# Altium schematic sheet 03-Gate_Driver.SchDoc
size B
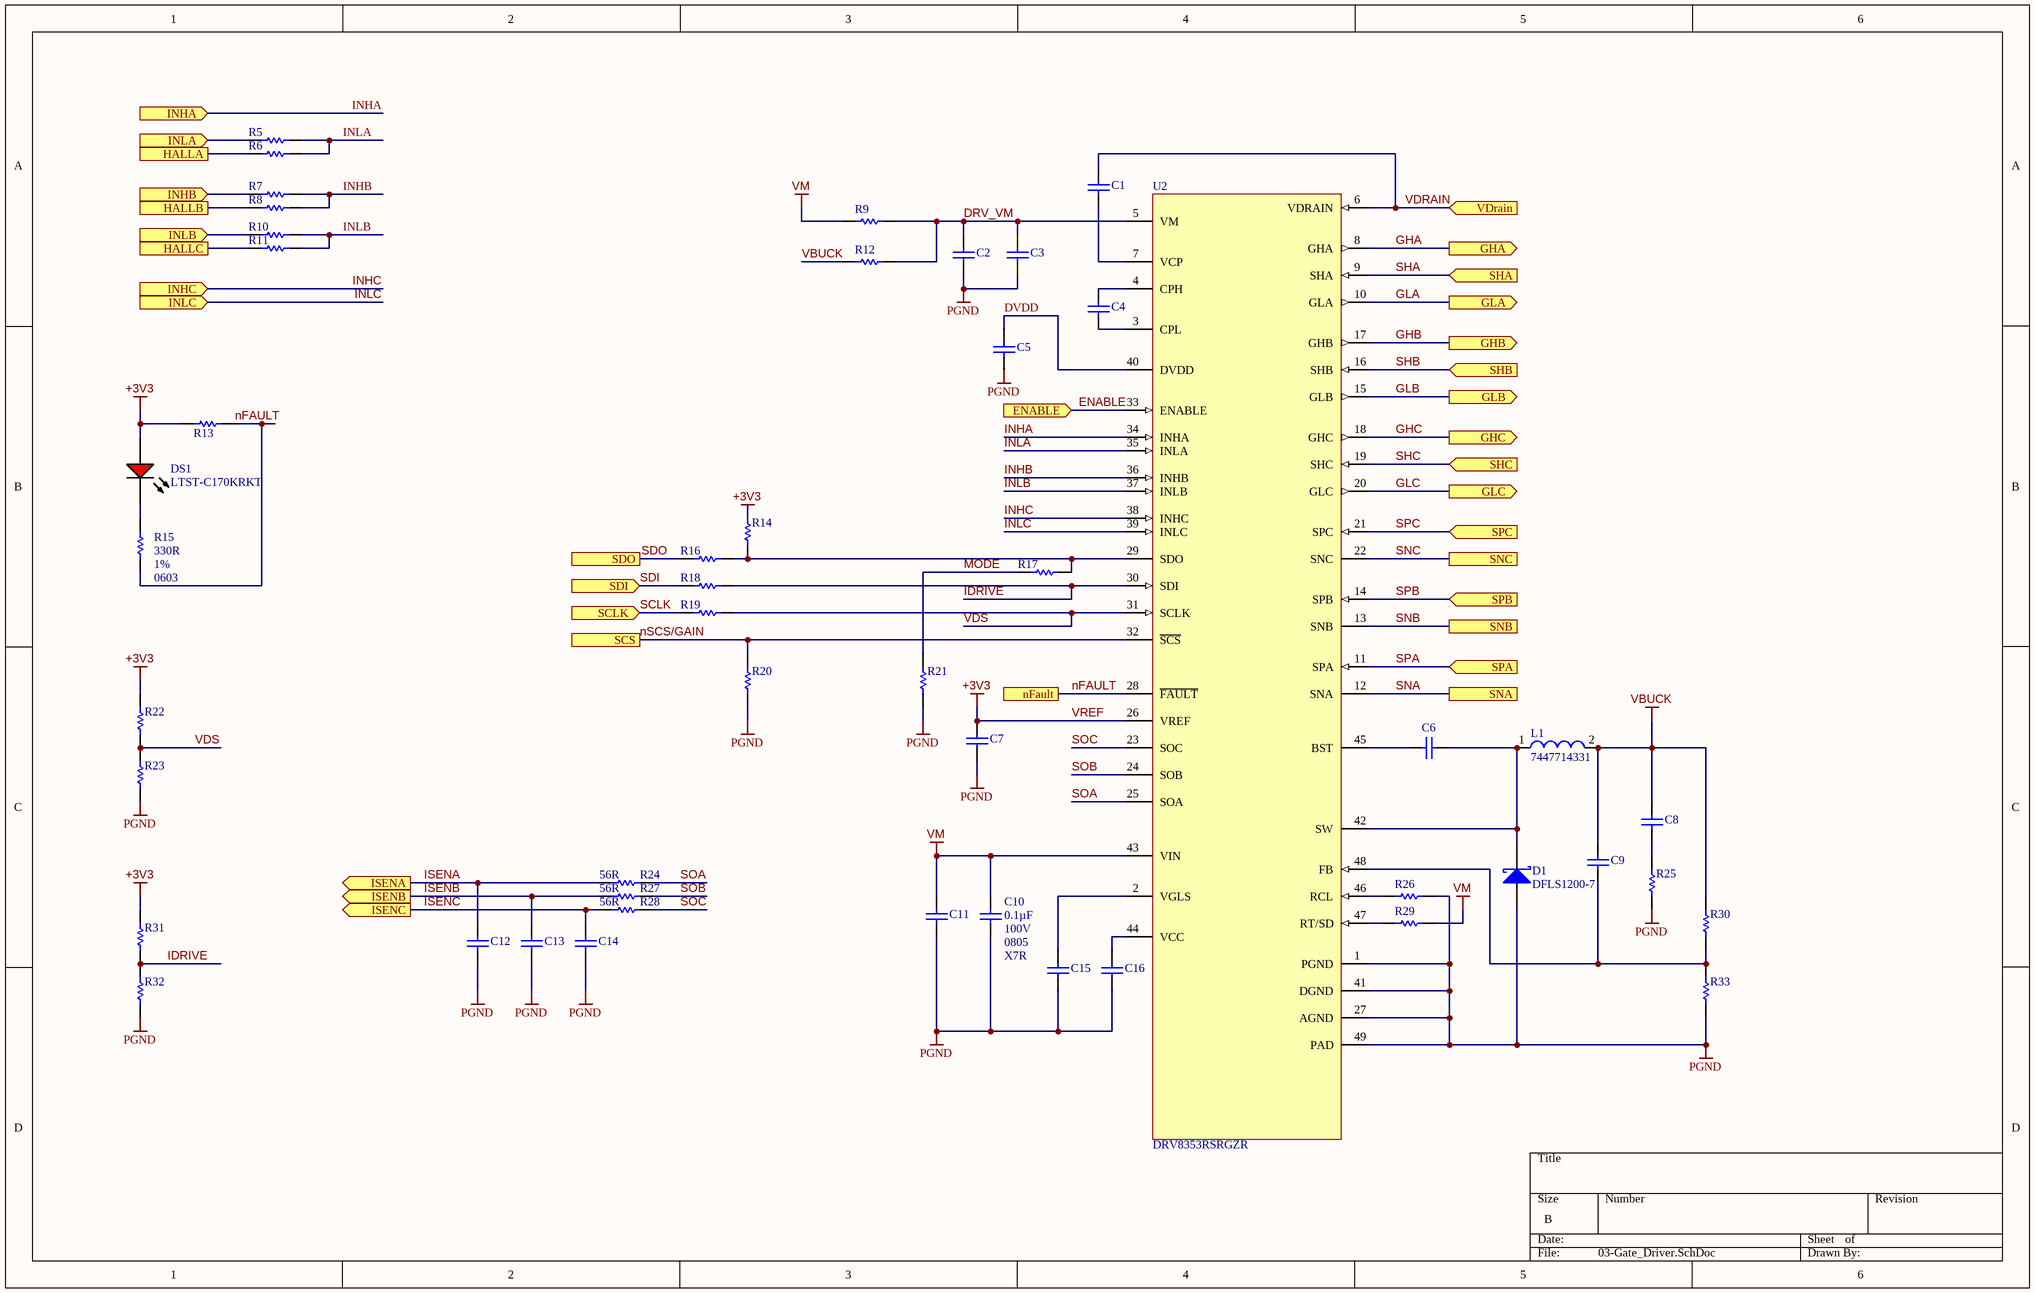
[diagram p0: 03-Gate_Driver.SchDoc]

## Parts
C1  GRM31CR72A105KA01L  [CAPC3216X180X55ML20T25]  (value not drawn)
C2  C5750X7S2A106M230KB  [TDK-C5750-2_L]  (value not drawn)
C3  C2012X7R2A104K125AA  [CAPC2013X145X20ML20]  (value not drawn)
C4  C0805C473K1RACTU  [CAPC2013X110X50LL20T25]  (value not drawn)
C5  C0603C105K4RACTU  [CAPC1608X90X35LL15T15]  (value not drawn)
C6  C0603C103K4RACTU  [CAPC1608X87X35ML15T15]  (value not drawn)
C7  C0603C104J4RACTU  [CAPC1608X87X35NL15T15]  (value not drawn)
C8  C2012X7R1H225K125AC  [CAPC2013X145X20LL20]  (value not drawn)
C9  GRM1885C1H362JA01D  [CAPC1608X90X35ML10T15]  (value not drawn)
C10  Temperature Coefficient: X7R  Voltage - Rated: 100V  Package Reference: 0805  Capacitance: 0.1µF  [CAPC2013X145X20ML20]  (hidden comment: C2012X7R2A104K125AA)
C11  C3216X7R2A105K160AA  [CAPC3216X180X20LL20]  (value not drawn)
C12  GRM188R71C222KA01D  [CAPC1608X90X35NL10T15]  (value not drawn)
C13  GRM188R71C222KA01D  [CAPC1608X90X35NL10T15]  (value not drawn)
C14  GRM188R71C222KA01D  [CAPC1608X90X35NL10T15]  (value not drawn)
C15  C0805C105K3RACTU  [CAPC2013X140X50LL20T25]  (value not drawn)
C16  C0603C105K4RACTU  [CAPC1608X90X35LL15T15]  (value not drawn)
D1  DFLS1200-7  [DIOD-POWERDI123-2_A_V]
DS1  LTST-C170KRKT  [LTST-C170KRKT_V]
L1  7447714331  [WE-PD 1050]
R5  ERJ-3GEY0R00V  [RESC1608X55X30NL15T15]  (value not drawn)
R6  ERJ-3GEY0R00V  [RESC1608X55X30NL15T15]  (value not drawn)
R7  ERJ-3GEY0R00V  [RESC1608X55X30NL15T15]  (value not drawn)
R8  ERJ-3GEY0R00V  [RESC1608X55X30NL15T15]  (value not drawn)
R9  ERJ-3GEY0R00V  [RESC1608X55X30NL15T15]  (value not drawn)
R10  ERJ-3GEY0R00V  [RESC1608X55X30NL15T15]  (value not drawn)
R11  ERJ-3GEY0R00V  [RESC1608X55X30NL15T15]  (value not drawn)
R12  ERJ-3GEY0R00V  [RESC1608X55X30NL15T15]  (value not drawn)
R13  RG1608P-103-B-T5  [RESC1608X50X30NL20T20]  (value not drawn)
R14  ERJ-3GEYJ102V  [RESC1608X55X30ML15T15]  (value not drawn)
R15  Case Code (Imperial): 0603  Tolerance: 1%  Resistance: 330R  [RESC1608X55X30NL15T15]  (hidden comment: ERJ3EKF3300V)
R16  ERJ-3GEY0R00V  [RESC1608X55X30NL15T15]  (value not drawn)
R17  ERJ-3GEY0R00V  [RESC1608X55X30NL15T15]  (value not drawn)
R18  ERJ-3GEY0R00V  [RESC1608X55X30NL15T15]  (value not drawn)
R19  ERJ-3GEY0R00V  [RESC1608X55X30NL15T15]  (value not drawn)
R20  CRCW060347K0JNEA  [RESC1609X50X30ML10T20]  (value not drawn)
R21  CRCW060347K0JNEA  [RESC1609X50X30ML10T20]  (value not drawn)
R22  CRCW060375K0JNEA  [RESC1609X50X30ML10T20]  (value not drawn)
R23  CRCW060375K0JNEA  [RESC1609X50X30ML10T20]  (value not drawn)
R24  Resistance: 56R  [RESC1609X50X30ML10T20]  (hidden comment: CRCW060356R0FKEA)
R25  2R61 1% 0603(1608)  [RESC0603(1608)_N]  (value not drawn)
R26  CRCW0603107KFKEA  [RESC1609X50X30LL10T20]  (value not drawn)
R27  Resistance: 56R  [RESC1609X50X30ML10T20]  (hidden comment: CRCW060356R0FKEA)
R28  Resistance: 56R  [RESC1609X50X30ML10T20]  (hidden comment: CRCW060356R0FKEA)
R29  ERJ-3EKF2743V  [RESC1608X55X30NL15T15]  (value not drawn)
R30  RG1608P-103-B-T5  [RESC1608X50X30NL20T20]  (value not drawn)
R31  CRCW060375K0JNEA  [RESC1609X50X30ML10T20]  (value not drawn)
R32  CRCW060375K0JNEA  [RESC1609X50X30ML10T20]  (value not drawn)
R33  RG1608P-2611-B-T5  [RESC1608X50X30NL20T20]  (value not drawn)
U2  DRV8353RSRGZR  [DRV8353RS]

## Ports
ENABLE (in), GHA (out), GHB (out), GHC (out), GLA (out), GLB (out), GLC (out), HALLA, HALLB, HALLC, INHA (in), INHB (in), INHC (in), INLA (in), INLB (in), INLC (in), ISENA (out), ISENB (out), ISENC (out), nFault, SCLK (in), SCS, SDI (in), SDO, SHA (in), SHB (in), SHC (in), SNA, SNB, SNC, SPA (in), SPB (in), SPC (in), VDrain (in)

## Nets
PGND: C2.1 C3.1 C5.1 C7.1 C10.1 C11.1 C12.1 C13.1 C14.1 C15.1 C16.1 D1.1(A) R20.1 R21.1 R23.2 R25.1 R26.2 R32.2 R33.1 U2.1(PGND) U2.27(AGND) U2.41(DGND) U2.49(PAD)
VBUCK: C8.2 C9.2 L1.2 R12.1 R30.2
VM: C10.2 C11.2 R9.1 R29.2 U2.43(VIN)
VREF: C7.2 DS1.1(A) R13.2 R14.2 R22.1 R31.1 U2.26(VREF)  [also labelled +3V3]
DRV_VM: C2.2 C3.2 R9.2 R12.2 U2.5(VM)
DVDD: C5.2 U2.40(DVDD)
ENABLE: U2.33(ENABLE) ; port ENABLE
GHA: U2.8(GHA) ; port GHA
GHB: U2.17(GHB) ; port GHB
GHC: U2.18(GHC) ; port GHC
GLA: U2.10(GLA) ; port GLA
GLB: U2.15(GLB) ; port GLB
GLC: U2.20(GLC) ; port GLC
HALLA: R6.1 ; port HALLA
HALLB: R8.1 ; port HALLB
HALLC: R11.1 ; port HALLC
IDRIVE: R18.2 R31.2 R32.1 U2.30(SDI)
INHA: U2.34(INHA) ; port INHA
INHB: R7.2 R8.2 U2.36(INHB)
INHB: R7.1 ; port INHB  [a separate net that carries the same name]
INHC: U2.38(INHC) ; port INHC
INLA: R5.2 R6.2 U2.35(INLA)
INLA: R5.1 ; port INLA  [a separate net that carries the same name]
INLB: R10.2 R11.2 U2.37(INLB)
INLB: R10.1 ; port INLB  [a separate net that carries the same name]
INLC: U2.39(INLC) ; port INLC
ISENA: C12.2 R24.1 ; port ISENA
ISENB: C13.2 R27.1 ; port ISENB
ISENC: C14.2 R28.1 ; port ISENC
MODE: R17.1 R21.2
nFAULT: R13.1 R15.1 U2.28(~{FAULT}) ; port nFault
nSCS/GAIN: R20.2 U2.32(~{SCS}) ; port SCS
SCLK: R19.1 ; port SCLK
SDI: R18.1 ; port SDI
SDO: R16.1 ; port SDO
SHA: U2.9(SHA) ; port SHA
SHB: U2.16(SHB) ; port SHB
SHC: U2.19(SHC) ; port SHC
SNA: U2.12(SNA) ; port SNA
SNB: U2.13(SNB) ; port SNB
SNC: U2.22(SNC) ; port SNC
SOA: R24.2 U2.25(SOA)
SOB: R27.2 U2.24(SOB)
SOC: R28.2 U2.23(SOC)
SPA: U2.11(SPA) ; port SPA
SPB: U2.14(SPB) ; port SPB
SPC: U2.21(SPC) ; port SPC
VDRAIN: C1.2 U2.6(VDRAIN) ; port VDrain
VDS: R19.2 R22.2 R23.1 U2.31(SCLK)
NetC1_1: C1.1 U2.7(VCP)
NetC4_1: C4.1 U2.3(CPL)
NetC4_2: C4.2 U2.4(CPH)
NetC6_1: C6.1 U2.45(BST)
NetC6_2: C6.2 D1.2(K) L1.1 U2.42(SW)
NetC8_1: C8.1 R25.2
NetC9_1: C9.1 R30.1 R33.2 U2.48(FB)
NetC15_2: C15.2 U2.2(VGLS)
NetC16_2: C16.2 U2.44(VCC)
NetDS1_2: DS1.2(K) R15.2
NetR14_1: R14.1 R16.2 R17.2 U2.29(SDO)
NetR26_1: R26.1 U2.46(RCL)
NetR29_1: R29.1 U2.47(RT/SD)

## Library data of the parts
C1 = CMP-2000-04948-1: Chip Capacitor, 1 uF, +/- 10%, 100 V, -55 to 125 degC, 1206 (3216 Metric), RoHS, Tape and Reel; Manufacturer: Murata; Catalog Drawings: GRMSeries_1206_1.6; Featured Product: GA3SafetyRecognizedCapsandHi-CapMLCC; Online Catalog: GRMSeries; Temperature Coefficient: X7R; Product Training Modules: High-CapMultilayerCeramicCapacitors; Other Names: 490-3909-6; Voltage - Rated: 100V; Capacitance: 1µF; Thickness (Max): 0.071"(1.80mm); Height - Seated (Max): -; Features: -; Applications: GeneralPurpose; Manufacturer URL: http://www.murata.com/; Standard Package: 1; Size / Dimension: 0.126"Lx0.063"W(3.20mmx1.60mm); Package Reference: 1206; Series: GRM; Package / Case: 1206(3216Metric); Datasheet Version: Sep-11; Ratings: -; Category: Capacitors; Datasheet URL: https://datasheet.ciiva.com/29199/454987-da-01-en-vs-kondensator-1206-29199435.pdf; Operating Temperature: -55degC~125degC; Lead Spacing: -; Family: CeramicCapacitors; Tolerance: ±10%; Packaging: Digi-Reel; Mounting Type: SurfaceMount,MLCC; Package Description: 2-Pin Surface Mount Device, Body 3.2 x 1.6 mm; Lead Style: -
C2 = CMP-2000-06059-1: Chip Capacitor, 10 uF, +/- 20%, 100 V, -55 to 125 degC, 2220 (5750 Metric), RoHS, Tape and Reel; PCN Part Number: MLCCPartNumberChange30/Nov/2012; Manufacturer: TDK; Other Names: 445-5212-1; Featured Product: Compact,High-CapacitanceMultilayerCeramicChipCapacitorsMidVoltageX7S-100VMLCCsC-SeriesMidVoltageMLCCs; Product Training Modules: SEAT,CCV,andTVCLDesignToolsCSeriesMidVoltageCapacitorsFamilyGuidetoReplacinganElectrolyticCapacitorwithanMLCC; Kits: 445-9009-KIT-ND-KITCAPCERHICAP100V-630VSMDSAMPLEKIT1008-ND-KITCAPCERMLCC100V-630V; Catalog Drawings: CSERIES_2220_2.5; Online Catalog: CSeries,MidVoltage; Temperature Coefficient: X7S; Voltage - Rated: 100V; Capacitance: 10µF; Package Description: SMD, 2-Leads, Body 6.1 x 5.4 mm; Manufacturer URL: http://www.tdk.com/; Size / Dimension: 0.224"Lx0.197"W(5.70mmx5.00mm); RoHS Information: RoHSCertificate-MLCC; Package Reference: C5750-2; Applications: GeneralPurpose; Datasheet Version: 09/2013; Features: -; Datasheet URL: https://datasheet.ciiva.com/24216/c5750x7s2a106m230kb-265716-24216594.pdf; Standard Package: 1; Lead Spacing: -; Family: CeramicCapacitors; Thickness (Max): 0.098"(2.50mm); Packaging: CutTape(CT); Mounting Technology: SurfaceMount; Lead Style: -; Height - Seated (Max): -; Package / Case: 2220(5750Metric); Series: C; Category: Capacitors; Ratings: -; Operating Temperature: -55°C~125°C; Mounting Type: SurfaceMount,MLCC; Tolerance: ±20%
C3 = CMP-2000-05453-1: Chip Capacitor, 100 nF, +/- 10%, 100 V, -55 to 1255 degC, 0805 (2012 Metric), RoHS, Tape and Reel; Manufacturer: TDK; PCN Part Number: MLCCPartNumberChange30/Nov/2012; Temperature Coefficient: X7R; Voltage - Rated: 100V; Kits: SAMPLEKIT1008-ND-KITCAPCERMLCC100V-630V; Other Names: 445-1418-1; Online Catalog: CSeries,MidVoltage; Featured Product: C-SeriesMidVoltageMLCCs; Catalog Drawings: CSERIES_2012-0805_1.45; Product Training Modules: HighCapacitanceReplacementSEAT,CCV,andTVCLDesignToolsGuidetoReplacinganElectrolyticCapacitorwithanMLCC; Capacitance: 0.1µF; Applications: GeneralPurpose; Datasheet Version: Jul-13; Mounting Type: SurfaceMount,MLCC; Height - Seated (Max): -; Packaging: CutTape(CT); Datasheet URL: https://datasheet.ciiva.com/11788/0900766b80fc5cba-11788142.pdf; Tolerance: ±10%; Package Reference: 805; Manufacturer URL: http://www.tdk.com/; Thickness (Max): 0.057"(1.45mm); Series: C; Lead Style: -; Operating Temperature: -55degC~125degC; Category: Capacitors; Package Description: 2-Pin Surface Mount Device, Body 2 x 1.25 mm; Standard Package: 1; Package / Case: 0805(2012Metric); Family: CeramicCapacitors; RoHS Information: RoHSCertificate-MLCC; Size / Dimension: 0.079"Lx0.049"W(2.00mmx1.25mm); Lead Spacing: -; Ratings: -; Features: -
C4 = CMP-2007-03657-1: Manufacturer: Kemet; Part Number: C0805C473K1RACTU
C5 C16 = CMP-2006-02240-1: Manufacturer: Kemet; Part Number: C0603C105K4RACTU
C6 = CMP-2006-03042-1: Manufacturer: Kemet; Part Number: C0603C103K4RACTU
C7 = CMP-2006-03054-1: Manufacturer: Kemet; Part Number: C0603C104J4RACTU
C8 = CMP-2000-06040-1: Chip Capacitor, 2.2 uF, +/- 10%, 50 V, -55 to 125 degC, 0805 (2012 Metric), RoHS, Tape and Reel; Manufacturer: TDK; PCN Part Number: MLCCPartNumberChange30/Nov/2012; Other Names: 445-5968-1; Temperature Coefficient: X7R; Catalog Drawings: CSERIES_2012-0805_1.45; Kits: 445-9015-KIT-ND-KITMLCC1000PF-47UF080510-50V445-9003-KIT-ND-KITCAPCERHICAPMLCCSMD445-173086-KIT-ND-C0402-2220X7R6.3-50V1,000PF-; Online Catalog: CSeries,GeneralPurpose; Voltage - Rated: 50V; Capacitance: 2.2µF; Product Training Modules: CSeriesGeneralApplicationsSEAT,CCV,andTVCLDesignToolsGuidetoReplacinganElectrolyticCapacitorwithanMLCC; Operating Temperature: -55°C~125°C; Features: -; Tolerance: ±10%; Datasheet URL: https://datasheet.ciiva.com/24216/c2012x7r1h225k125ac-265016-24216364.pdf; Lead Style: -; Size / Dimension: 0.079"Lx0.049"W(2.00mmx1.25mm); Mounting Technology: SurfaceMount; Package Reference: 0805; Thickness (Max): 0.057"(1.45mm); RoHS Information: RoHSCertificate-MLCC; Height - Seated (Max): -; Manufacturer URL: http://www.tdk.com/; Standard Package: 1; Category: Capacitors; Package Description: 2-Pin Surface Mount Device, Body 2 x 1.25 mm; Packaging: CutTape(CT); Series: C; Applications: GeneralPurpose; Package / Case: 0805(2012Metric); Ratings: -; Datasheet Version: 09/2013; Family: CeramicCapacitors; Mounting Type: SurfaceMount,MLCC; Lead Spacing: -
C9 = CMP-2006-02551-1: Manufacturer: Murata; Part Number: GRM1885C1H362JA01D
C10 = CMP-2000-05453-1: Chip Capacitor, 100 nF, +/- 10%, 100 V, -55 to 1255 degC, 0805 (2012 Metric), RoHS, Tape and Reel; Manufacturer: TDK; PCN Part Number: MLCCPartNumberChange30/Nov/2012; Kits: SAMPLEKIT1008-ND-KITCAPCERMLCC100V-630V; Other Names: 445-1418-1; Online Catalog: CSeries,MidVoltage; Featured Product: C-SeriesMidVoltageMLCCs; Catalog Drawings: CSERIES_2012-0805_1.45; Product Training Modules: HighCapacitanceReplacementSEAT,CCV,andTVCLDesignToolsGuidetoReplacinganElectrolyticCapacitorwithanMLCC; Applications: GeneralPurpose; Datasheet Version: Jul-13; Mounting Type: SurfaceMount,MLCC; Height - Seated (Max): -; Packaging: CutTape(CT); Datasheet URL: https://datasheet.ciiva.com/11788/0900766b80fc5cba-11788142.pdf; Tolerance: ±10%; Manufacturer URL: http://www.tdk.com/; Thickness (Max): 0.057"(1.45mm); Series: C; Lead Style: -; Operating Temperature: -55degC~125degC; Category: Capacitors; Package Description: 2-Pin Surface Mount Device, Body 2 x 1.25 mm; Standard Package: 1; Package / Case: 0805(2012Metric); Family: CeramicCapacitors; RoHS Information: RoHSCertificate-MLCC; Size / Dimension: 0.079"Lx0.049"W(2.00mmx1.25mm); Lead Spacing: -; Ratings: -; Features: -
C11 = CMP-2000-06049-1: Chip Capacitor, 1 uF, +/- 10%, 100 V, -55 to 125 degC, 1206 (3216 Metric), RoHS, Tape and Reel; Manufacturer: TDK; PCN Part Number: MLCCPartNumberChange30/Nov/2012; Kits: SAMPLEKIT1008-ND-KITCAPCERMLCC100V-630V; Product Training Modules: SEAT,CCV,andTVCLDesignToolsGuidetoReplacinganElectrolyticCapacitorwithanMLCC; Capacitance: 1µF; Featured Product: C-SeriesMidVoltageMLCCs; Voltage - Rated: 100V; Other Names: 445-4467-1; Catalog Drawings: CSERIES_1206_1.8; Online Catalog: CSeries,MidVoltage; Temperature Coefficient: X7R; Features: -; Family: CeramicCapacitors; Datasheet URL: http://www.farnell.com/datasheets/1484596.pdf; Mounting Technology: SurfaceMount; Mounting Type: SurfaceMount,MLCC; Datasheet Version: 08/2011; Standard Package: 1; Package / Case: 1206(3216Metric); Thickness (Max): 0.051"(1.30mm); Size / Dimension: 0.126"Lx0.063"W(3.20mmx1.60mm); Applications: GeneralPurpose; Package Reference: 1206; Operating Temperature: -55°C~125°C; Packaging: CutTape(CT); Package Description: 2-Pin Surface Mount Device, Body 3.2 x 1.6 mm; Ratings: -; Series: C; Tolerance: ±10%; Manufacturer URL: http://www.tdk.com/; Lead Spacing: -; Height - Seated (Max): -; Package URL: https://product.tdk.com/info/en/documents/chara_sheet/C3216X7R1V106K160AC.pdf; Lead Style: -; Category: Capacitors; RoHS Information: RoHSCertificate-MLCC
C12-C14 = CMP-2006-02517-1: Manufacturer: Murata; Part Number: GRM188R71C222KA01D
C15 = CMP-2007-03234-1: Manufacturer: Kemet; Part Number: C0805C105K3RACTU
D1 = CMP-2000-07540-1: High Voltage Schottky Barrier Rectifier, 200 V, 1 A, -65 to 175 degC, 2-Pin SMD, RoHS, Tape and Reel; Manufacturer: Diodes Inc; Peak Non-Repetitive Surge Current: 40A; Max Repetitive Reverse Voltage (Vrrm): 200V; Peak Reverse Current: 2uA; Capacitance: 23pF; Forward Current: 1A; Forward Voltage: 850mV; Element Configuration: Single; Polarity: Standard; Number of Pins: 2; Package Description: 2-Pin Small Outline Diode, Body 2.8 x 1.78 mm; Mount: SurfaceMount; Max Operating Temperature: 150degC; Package Quantity: 3000; Lead Free: LeadFree; Max Forward Surge Current (Ifsm): 40A; Height: 0.98mm; Datasheet Version: Rev. 6-2, 10/2008; Package Reference: POWERDI123-2_A; Reverse Voltage (DC): 200V; REACH SVHC: NoSVHC; Min Operating Temperature: -65degC; RoHSCompliant: true; Width: 1.78mm; Contact Plating: Matte; Termination: SMD/SMT; Manufacturer URL: http://www.diodes.com/; Voltage Rating (DC): 200V; Length: 2.8mm; Output Current: 1A; Packaging: TapeandReel; Current Rating: 1A; Radiation Hardening: No; Mounting Technology: SurfaceMount; Average Rectified Current: 1A; Datasheet URL: https://www.diodes.com/assets/Datasheets/ds30628.pdf
DS1 = CMP-2000-07593-1: LED Red, 75 mW, 54 mcd, -55 to 85 degC, 2-Pin SMD, RoHS, Tape and Reel; Manufacturer: Lite-On; Lens Transparency: Clear; Number of Elements: 1; Power Rating: 75mW; Luminous Intensity: 54mcd; Viewing Angle: 130degrees; Forward Current: 30mA; Wavelength: 639nm; Lens Style: Rectangular; Case\/Package: 0805; Test Current: 20mA; Dominant Wavelength: 631nm; Forward Voltage: 2V; Lens Colour: Colorless; Min Operating Temperature: -55degC; RoHSCompliant: True; Length: 3.2mm; Width: 1.25mm; Mount: SurfaceMount; Packaging: TapeandReel; Number of LEDs: 1; Radiation Hardening: No; Datasheet URL: http://optoelectronics.liteon.com/upload/download/DS-22-99-0150/LTST-C170KRKT.pdf; Datasheet Version: Rev. D, 11/2014; Case Code (Metric): 2012; Height: 1.1mm; Number of Pins: 2; Package Description: 2-Pin Surface Mount Device, Body 2 x 1.25 mm; Manufacturer URL: http://www.us.liteon.com/; Lead Free: LeadFree; Illumination Colour: Red; Colour: Red; Case Code (Imperial): 0805; Max Operating Temperature: 85degC; Power Dissipation: 75mW; Mounting Technology: SurfaceMount; Package Reference: C170KRKT; Package Quantity: 1; Depth: 1.6mm
L1 = CMP-1396-00019-1: SMD-Shielded Power Inductor WE-PD, L=330 µH; Manufacturer: Wuerth Elektronik; Inductance: 330 ÂµH; PackageReference: WE-PD 1050; ComponentLink1URL: http://www.we-online.com; ComponentLink1Description: Manufacturer URL; ComponentLink2Description: Datasheet; PartNumber: 7447714331; ComponentLink2URL: http://www.we-online.de/katalog/media/pdf/7447714331.pdf
R5-R12 R16-R19 = CMP-2000-00700-1: Manufacturer: Panasonic; Part Number: ERJ-3GEY0R00V
R13 R30 = CMP-2000-01968-1: Manufacturer: Susumu; Part Number: RG1608P-103-B-T5
R14 = CMP-2000-00703-1: Manufacturer: Panasonic; Part Number: ERJ-3GEYJ102V
R15 = CMP-2000-00435-1: Manufacturer: Panasonic; Power Rating: 100mW; Voltage Rating: 75V; Temperature Coefficient: 100ppm/°C; Part Number: ERJ3EKF3300V; Supplier 1: Newark; Supplier Part Number 1: 85Y8676; Manufacturer Part Number: ERJ3EKF3300V; Stock 1: 0; RoHS: Yes; Mount: Surface Mount; Case/Package: 0603; Number of Pins: 2; Weight: 7.1E-05oz; Case Code (Metric): 1608; Contact Plating: Tin; Min Operating Temperature: -55°C; Max Operating Temperature: 155°C; Packaging: Tape and Reel; Composition: Thick Film; Package Quantity: 5000; Military Standard: Not; Termination: SMD/SMT; Number of Terminations: 2; Max Power Dissipation: 100mW; Voltage Rating (DC): 75V; Features: Automotive AEC-Q200; Length: 1.6mm; Height: 0.45mm; Width: 0.8mm; Depth: 0.8mm; Radiation Hardening: No; REACH SVHC: No SVHC; Lead Free: Lead Free; ComponentLink1URL: https://datasheet.ciiva.com/7886/aoa0000ce2-7886729.pdf?src-supplier=Element14; ComponentLink1Description: https://datasheet.ciiva.com/7886/aoa0000ce2-7886729.pdf?src-supplier=Element14; ComponentLink2URL: https://datasheet.ciiva.com/48531/aoa0000ce2-48531001.pdf?src-supplier=Avnet; ComponentLink2Description: https://datasheet.ciiva.com/48531/aoa0000ce2-48531001.pdf?src-supplier=Avnet; ComponentLink3URL: https://datasheet.ciiva.com/22721/426256-22721099.pdf?src-supplier=Element14; ComponentLink3Description: https://datasheet.ciiva.com/22721/426256-22721099.pdf?src-supplier=Element14; ComponentLink4URL: https://datasheet.ciiva.com/46373/1678782-46373899.pdf?src-supplier=Element14; ComponentLink4Description: https://datasheet.ciiva.com/46373/1678782-46373899.pdf?src-supplier=Element14; ComponentLink5URL: https://datasheet.ciiva.com/9117/aoa0000ce2-9117132.pdf?src-supplier=Avnet; ComponentLink5Description: https://datasheet.ciiva.com/9117/aoa0000ce2-9117132.pdf?src-supplier=Avnet; ComponentLink6URL: https://datasheet.ciiva.com/46373/1678782-46373900.pdf?src-supplier=Element14; ComponentLink6Description: https://datasheet.ciiva.com/46373/1678782-46373900.pdf?src-supplier=Element14
R20 R21 = CMP-2000-03381-1: Manufacturer: Vishay Dale; Part Number: CRCW060347K0JNEA
R22 R23 R31 R32 = CMP-2000-03572-1: Manufacturer: Vishay Dale; Part Number: CRCW060375K0JNEA
R24 R27 R28 = CMP-2000-03471-1: Manufacturer: Vishay Dale; Tolerance: 1%; Power Rating: 100mW; Voltage Rating: 75V; Temperature Coefficient: 100ppm/°C; Part Number: CRCW060356R0FKEA; Supplier 1: Future Electronics; Supplier Part Number 1: CRCW060356R0FKEA-CUTT; Manufacturer Part Number: CRCW060356R0FKEA; Stock 1: 319717; Pricing 1: 1=0.09800, 250=0.00660, 750=0.00620, 1500=0.00590, 2500=0.00580 (USD); RoHS: Yes; Case/Package: 0603; Number of Pins: 2; Weight: 7.1E-05oz; Case Code (Imperial): 0603; Case Code (Metric): 1608; Contact Plating: Tin; Min Operating Temperature: -55°C; Max Operating Temperature: 155°C; Packaging: Tape and Reel; Composition: Thick Film; Package Quantity: 10; Number of Terminations: 2; Max Power Dissipation: 100mW; Military Standard: Not; Voltage Rating (DC): 75V; Termination: SMD/SMT; Features: Automotive AEC-Q200; Length: 1.55mm; Height: 0.45mm; Width: 0.85mm; Depth: 0.85mm; Radiation Hardening: No; REACH SVHC: Unknown; Lead Free: Lead Free; ComponentLink1URL: https://datasheet.ciiva.com/11810/0900766b80d98afc-11810033.pdf?src-supplier=RSComponents; ComponentLink1Description: https://datasheet.ciiva.com/11810/0900766b80d98afc-11810033.pdf?src-supplier=RSComponents; ComponentLink2URL: https://datasheet.ciiva.com/7672/1697337-7672917.pdf?src-supplier=Element14; ComponentLink2Description: https://datasheet.ciiva.com/7672/1697337-7672917.pdf?src-supplier=Element14; ComponentLink3URL: https://datasheet.ciiva.com/16883/dcrcwe3-16883910.pdf?src-supplier=Avnet+Europe; ComponentLink3Description: https://datasheet.ciiva.com/16883/dcrcwe3-16883910.pdf?src-supplier=Avnet+Europe; ComponentLink4URL: https://datasheet.ciiva.com/2465/dcrcwe3-2465642.pdf?src-supplier=Digi-Key; ComponentLink4Description: https://datasheet.ciiva.com/2465/dcrcwe3-2465642.pdf?src-supplier=Digi-Key; ComponentLink5URL: https://datasheet.ciiva.com/16507/dcrcw-16507994.pdf?src-supplier=Future+Electronics; ComponentLink5Description: https://datasheet.ciiva.com/16507/dcrcw-16507994.pdf?src-supplier=Future+Electronics; ComponentLink6URL: https://datasheet.ciiva.com/16785/70201119-16785354.pdf?src-supplier=Allied+Electronics; ComponentLink6Description: https://datasheet.ciiva.com/16785/70201119-16785354.pdf?src-supplier=Allied+Electronics; ComponentLink7URL: https://datasheet.ciiva.com/2465/dcrcwe3-2465643.pdf?src-supplier=Digi-Key; ComponentLink7Description: https://datasheet.ciiva.com/2465/dcrcwe3-2465643.pdf?src-supplier=Digi-Key; ComponentLink8URL: https://datasheet.ciiva.com/3257/dcrcwe3-3257739.pdf?src-supplier=Avnet; ComponentLink8Description: https://datasheet.ciiva.com/3257/dcrcwe3-3257739.pdf?src-supplier=Avnet; ComponentLink9URL: https://datasheet.ciiva.com/22704/1697337-22704443.pdf?src-supplier=Element14; ComponentLink9Description: https://datasheet.ciiva.com/22704/1697337-22704443.pdf?src-supplier=Element14; ComponentLink10URL: https://datasheet.ciiva.com/2465/dcrcwe3-2465644.pdf?src-supplier=Digi-Key; ComponentLink10Description: https://datasheet.ciiva.com/2465/dcrcwe3-2465644.pdf?src-supplier=Digi-Key; ComponentLink11URL: https://datasheet.ciiva.com/3257/dcrcwe3-3257740.pdf?src-supplier=Avnet; ComponentLink11Description: https://datasheet.ciiva.com/3257/dcrcwe3-3257740.pdf?src-supplier=Avnet
R25 = CMP-1012-00216-1: 2R61 0.1W 1% 0603 (1608 Metric)  SMD; Case-EIA: 0603; Case-Metric: 1608; Value: 2.61 Ohm; Power: 0.1 W; Tolerance: 1 %; Technology: SMT
R26 = CMP-2000-03834-1: Manufacturer: Vishay Dale; Part Number: CRCW0603107KFKEA
R29 = CMP-2000-00395-1: Manufacturer: Panasonic; Part Number: ERJ-3EKF2743V
R33 = CMP-2000-02148-1: Manufacturer: Susumu; Part Number: RG1608P-2611-B-T5